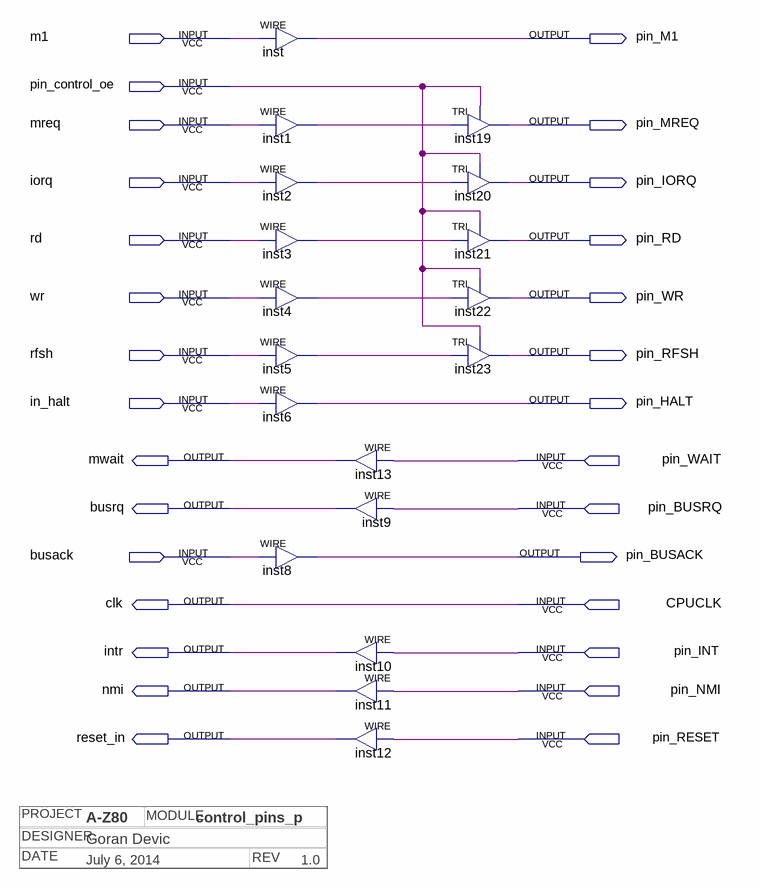
[diagram p0: schematic sheet]
// Quartus schematic control_pins_p.bdf as structural Verilog: 18 symbols, 29 pins
// Title block: DATE: July 6, 2014; DESIGNER: Goran Devic; MODULE: control_pins_p; PROJECT: A-Z80; REV: 1.0
module control_pins_p (
  input  m1,
  input  pin_control_oe,
  input  mreq,
  input  iorq,
  input  rd,
  input  wr,
  input  rfsh,
  input  in_halt,
  input  pin_WAIT,
  input  pin_BUSRQ,
  input  busack,
  input  CPUCLK,
  input  pin_INT,
  input  pin_NMI,
  input  pin_RESET,
  output pin_M1,
  output pin_MREQ,
  output pin_IORQ,
  output pin_RD,
  output pin_WR,
  output pin_RFSH,
  output pin_HALT,
  output mwait,
  output busrq,
  output pin_BUSACK,
  output clk,
  output intr,
  output nmi,
  output reset_in
);

  wire inst1_out, inst2_out, inst3_out, inst4_out, inst5_out;

  assign pin_M1 = m1;  // WIRE inst
  assign inst1_out = mreq;  // WIRE inst1
  assign inst2_out = iorq;  // WIRE inst2
  assign inst3_out = rd;  // WIRE inst3
  assign inst4_out = wr;  // WIRE inst4
  assign inst5_out = rfsh;  // WIRE inst5
  assign pin_HALT = in_halt;  // WIRE inst6
  assign pin_BUSACK = busack;  // WIRE inst8
  assign mwait = pin_WAIT;  // WIRE inst13
  assign busrq = pin_BUSRQ;  // WIRE inst9
  assign intr = pin_INT;  // WIRE inst10
  assign nmi = pin_NMI;  // WIRE inst11
  assign reset_in = pin_RESET;  // WIRE inst12
  TRI inst19 (.IN(inst1_out), .OE(pin_control_oe), .OUT(pin_MREQ));
  TRI inst20 (.IN(inst2_out), .OE(pin_control_oe), .OUT(pin_IORQ));
  TRI inst21 (.IN(inst3_out), .OE(pin_control_oe), .OUT(pin_RD));
  TRI inst22 (.IN(inst4_out), .OE(pin_control_oe), .OUT(pin_WR));
  TRI inst23 (.IN(inst5_out), .OE(pin_control_oe), .OUT(pin_RFSH));

  assign clk = CPUCLK;
endmodule
